# EAGLE design G888b (EAGLE 4.11)
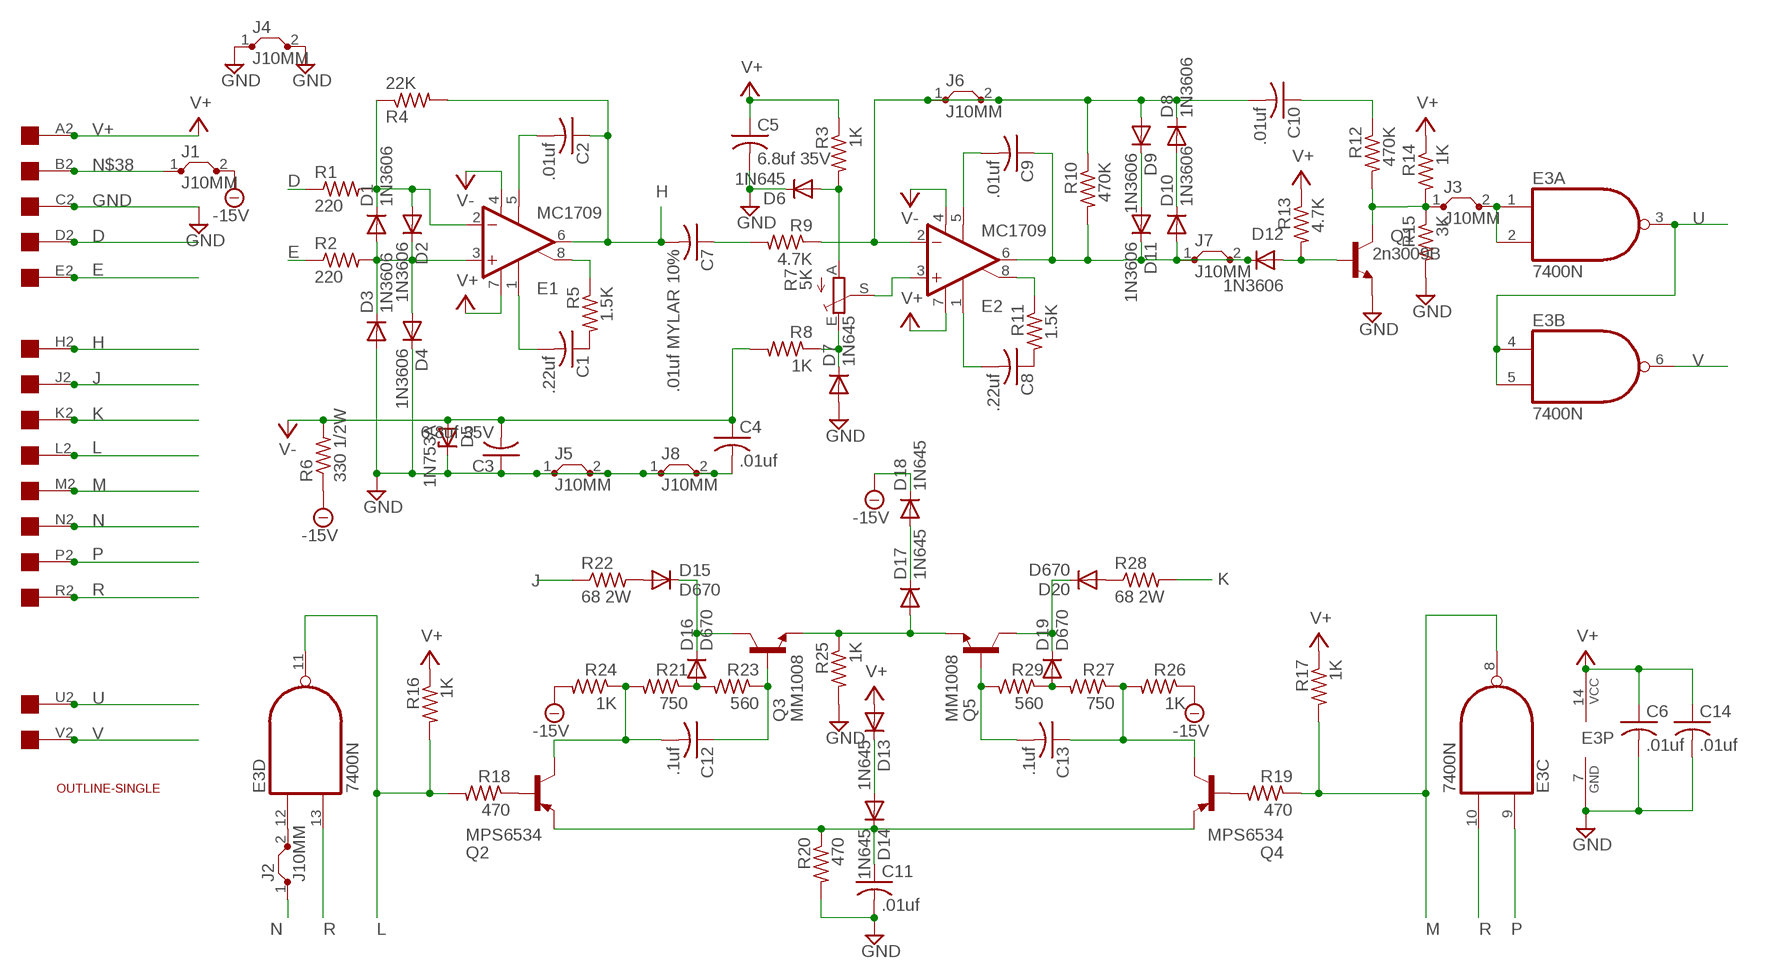
[diagram p0: schematic, sheet 1]

## Parts
C1  .22uf  C-US050-025X075  [C050-025X075]
C2  .01uf  C-US050-025X075  [C050-025X075]
C3  6.8uf 35V  C-US102-043X133  [C102-043X133]
C4  .01uf  C-US050-025X075  [C050-025X075]
C5  6.8uf 35V  C-US102-043X133  [C102-043X133]
C6  .01uf  C-US050-025X075  [C050-025X075]
C7  .01uf MYLAR 10%  C-US150-054X183  [C150-054X183]
C8  .22uf  C-US050-025X075  [C050-025X075]
C9  .01uf  C-US050-025X075  [C050-025X075]
C10  .01uf  C-US050-025X075  [C050-025X075]
C11  .01uf  C-US050-025X075  [C050-025X075]
C12  .1uf  C-US050-025X075  [C050-025X075]
C13  .1uf  C-US050-025X075  [C050-025X075]
C14  .01uf  C-US050-025X075  [C050-025X075]
D1  1N3606  1N4004  [DO41-10]
D2  1N3606  1N4004  [DO41-10]
D3  1N3606  1N4004  [DO41-10]
D4  1N3606  1N4004  [DO41-10]
D5  1N753A  ZENER-DIODEDO35Z10  [DO35Z10]
D6  1N645  1N4004  [DO41-10]
D7  1N645  1N4004  [DO41-10]
D8  1N3606  1N4004  [DO41-10]
D9  1N3606  1N4004  [DO41-10]
D10  1N3606  1N4004  [DO41-10]
D11  1N3606  1N4004  [DO41-10]
D12  1N3606  1N4004  [DO41-10]
D13  1N645  1N4004  [DO41-10]
D14  1N645  1N4004  [DO41-10]
D15  D670  1N4004  [DO41-10]
D16  D670  1N4004  [DO41-10]
D17  1N645  1N4004  [DO41-10]
D18  1N645  1N4004  [DO41-10]
D19  D670  1N4004  [DO41-10]
D20  D670  1N4004  [DO41-10]
E1  MC1709  LM3080N  [DIL08]
E2  MC1709  LM3080N  [DIL08]
E3  7400N  [DIL14]
J1  J10MM  [10]
J2  J10MM  [10]
J3  J10MM  [10]
J4  J10MM  [10]
J5  J10MM  [10]
J6  J10MM  [10]
J7  J10MM  [10]
J8  J10MM  [10]
Q1  2n3009B  2N1711  [TO39]
Q2  MPS6534  2N5415  [TO39]
Q3  MM1008  2N1711  [TO39]
Q4  MPS6534  2N5415  [TO39]
Q5  MM1008  2N1711  [TO39]
R1  220  R-US_0207/10  [0207/10]
R2  220  R-US_0207/10  [0207/10]
R3  1K  R-US_0207/10  [0207/10]
R4  22K  R-US_0207/10  [0207/10]
R5  1.5K  R-US_0207/10  [0207/10]
R6  330 1/2W  R-US_0411/15  [0411/15]
R7  5K  TRIM_EU-PTSPIN  [PT-SPIN]
R8  1K  R-US_0207/10  [0207/10]
R9  4.7K  R-US_0207/10  [0207/10]
R10  470K  R-US_0207/10  [0207/10]
R11  1.5K  R-US_0207/10  [0207/10]
R12  470K  R-US_0207/10  [0207/10]
R13  4.7K  R-US_0207/10  [0207/10]
R14  1K  R-US_0207/10  [0207/10]
R15  3K  R-US_0207/10  [0207/10]
R16  1K  R-US_0207/10  [0207/10]
R17  1K  R-US_0207/10  [0207/10]
R18  470  R-US_0207/10  [0207/10]
R19  470  R-US_0207/10  [0207/10]
R20  470  R-US_0207/10  [0207/10]
R21  750  R-US_0207/10  [0207/10]
R22  68 2W  R-US_0817/22  [P0817/22]
R23  560  R-US_0207/10  [0207/10]
R24  1K  R-US_0207/10  [0207/10]
R25  1K  R-US_0207/10  [0207/10]
R26  1K  R-US_0207/10  [0207/10]
R27  750  R-US_0207/10  [0207/10]
R28  68 2W  R-US_0817/22  [P0817/22]
R29  560  R-US_0207/10  [0207/10]
U$1  EDGE-1  [EDGE-CON1]
U$4  OUTLINE-SINGLE  [SINGLE]

## Nets
-15V: D18.C J1.2 R6.1 R24.2 R26.1
D: R1.1 U$1.D2
E: R2.1 U$1.E2
GND: C3.1 C4.2 C5.2 C6.2 C11.2 C14.2 D3.A D4.C D5.C D6.C D7.A E3.7(P:GND) J4.1 J4.2 J5.1 J5.2 J8.1 J8.2 Q1.1(E) R15.2 R20.2 R25.2 U$1.C2
H: C2.1 C7.2 E1.6(OUT) R4.2 U$1.H2
J: R22.1 U$1.J2
K: R28.2 U$1.K2
L: E3.11(D:O) R16.2 R18.2 U$1.L2
M: E3.8(C:O) R17.2 R19.1 U$1.M2
N: J2.1 U$1.N2
N$1: C1.1 R5.2
N$2: C8.1 R11.2
N$3: D1.C D2.A E1.2(-IN) R1.2 R4.1
N$4: D1.A D2.C D3.C D4.A E1.3(+IN) R2.2
N$5: C8.2 E2.1(ON1)
N$6: C1.2 E1.1(ON1)
N$7: E1.8(ON2) R5.1
N$8: C2.2 E1.5(OPT)
N$9: D6.A R3.2 R7.A
N$10: C10.2 D8.C D9.A E2.2(-IN) J6.1 J6.2 R9.1 R10.1
N$11: E2.3(+IN) R7.S
N$12: D7.C R7.E R8.1
N$13: E2.8(ON2) R11.1
N$14: C9.2 E2.5(OPT)
N$15: C9.1 D10.A D11.C D12.C E2.6(OUT) J7.1 J7.2 R10.2
N$16: C7.1 R9.2
N$17: D9.C D11.A
N$18: D8.A D10.C
N$19: C10.1 R12.1
N$20: D12.A Q1.2(B) R13.2
N$21: J3.1 Q1.3(C) R12.2 R14.2 R15.1
N$22: D17.A Q3.1(E) Q5.1(E) R25.1
N$23: C11.1 D14.C Q2.1(E) Q4.1(E) R20.1
N$24: D13.C D14.A
N$25: Q2.2(B) R18.1
N$26: Q4.2(B) R19.2
N$27: D15.A R22.2
N$28: D16.A R21.1 R23.2
N$29: C12.2 Q2.3(C) R21.2 R24.1
N$30: C12.1 Q3.2(B) R23.1
N$31: D19.A R27.2 R29.1
N$32: C13.1 Q4.3(C) R26.2 R27.1
N$33: C13.2 Q5.2(B) R29.2
N$34: D20.A R28.1
N$35: D15.C D16.C Q3.3(C)
N$36: D19.C D20.C Q5.3(C)
N$37: D17.C D18.A
N$38: J1.1 U$1.B2
N$39: E3.12(D:I0) J2.2
N$40: E3.1(A:I0) E3.2(A:I1) J3.2
P: E3.9(C:I0) U$1.P2
R: E3.10(C:I1) E3.13(D:I1) U$1.R2
U: E3.3(A:O) E3.4(B:I0) E3.5(B:I1) U$1.U2
V: E3.6(B:O) U$1.V2
V+: C5.1 C6.1 C14.1 D13.A E1.7(V+) E2.7(V+) E3.14(P:VCC) R3.1 R13.1 R14.1 R16.1 R17.1 U$1.A2
V-: C3.2 C4.1 D5.A E1.4(V-) E2.4(V-) R6.2 R8.2
Unconnected: U$1.F2 U$1.S2 U$1.T2

## Library data of the parts
C1-C14 = rcl:C-US: CAPACITOR, American symbol
D1-D4 D6-D20 = diode:1N4004: DIODE general purpose rectifier, 1 A
D5 = diode:ZENER-DIODE: Z-Diode
E1 E2 = linear:*3080: OP AMP
E3 = 74xx-us:74*00: Quad 2-input NAND gate
J1-J8 = jumper:J: Bridge
Q1 Q3 Q5 = transistor-npn:2N1711: NPN Transistor
Q2 Q4 = transistor-pnp:2N5415*: PNP Transistror
R1-R6 R8-R29 = rcl:R-US_: RESISTOR, American symbol
R7 = pot:TRIM_EU-: POTENTIOMETER
U$1 = dec-con:EDGE-1: Single-Sided DEC Edge Connector -- (side 2)
U$4 = dec-con:OUTLINE-*: Board outlines for DEC boards.

## Board
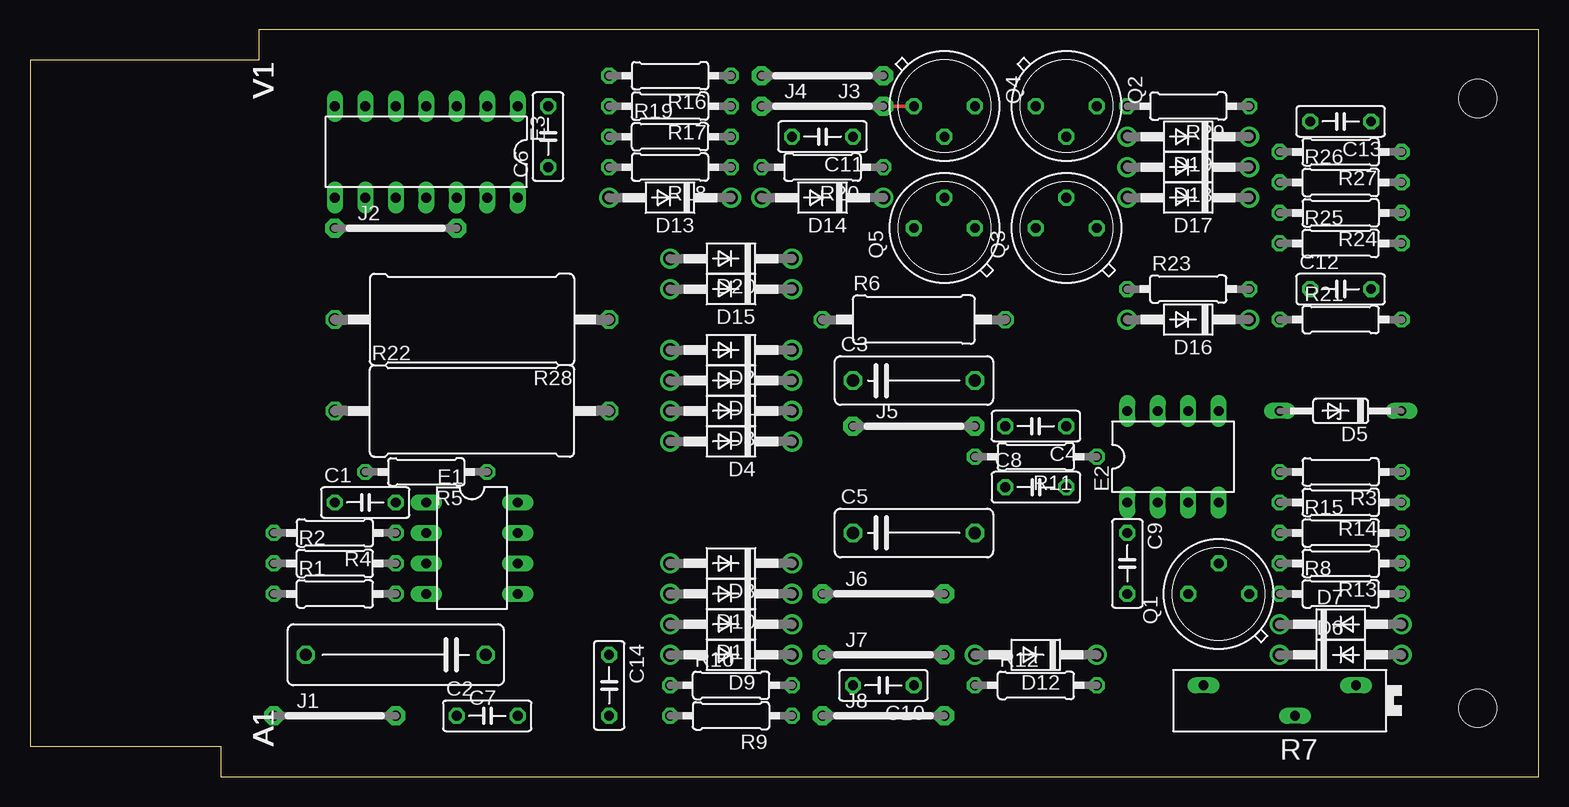
[diagram p1: board, top side]
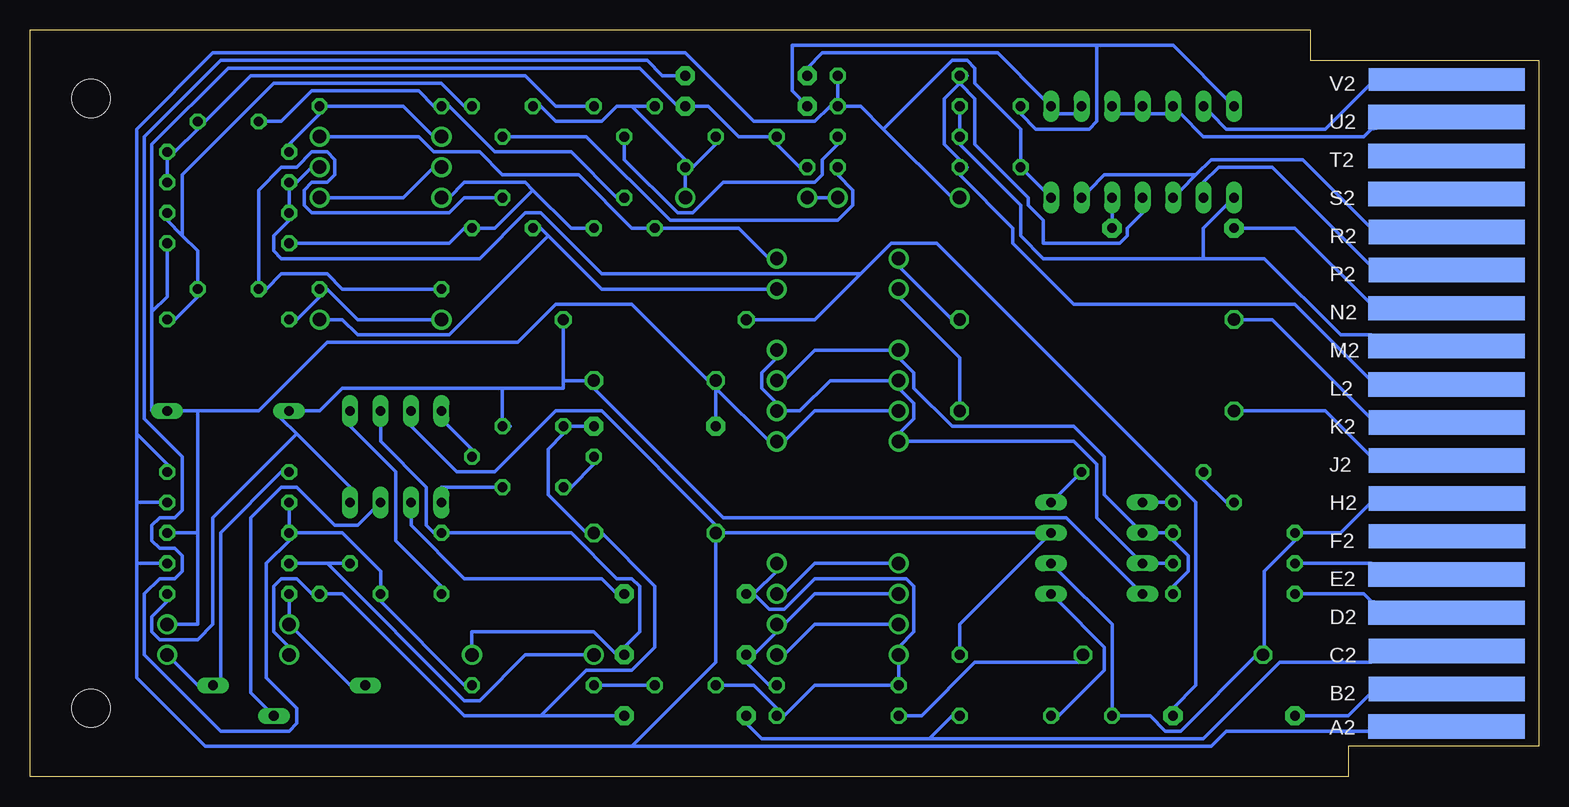
[diagram p2: board, bottom side, seen from below]

Size 125.73 x 62.23 mm. Coordinates in mm from the lower left corner, seen from the top.
Copper layers (1*16): Top 0.035mm / dielectric 1.5mm / Bottom 0.035mm
Design rules "10mils": minimum track width 12mil, minimum drill 28mil, track to track 10mil, track to pad 10mil, pad to pad 10mil, via to via 10mil, smd to smd 10mil, copper to edge 25mil, drill to drill 10mil, minimum pad ring 10mil, minimum via ring 8mil, stop-mask expansion 0mil, vias tented up to drill 0mil, thermal gap 10mil

### Footprints (pad centres in the part's own frame; a part is rotated, then mirrored left to right if it is on the bottom)
C050-025X075 = drill 0.813 octagon: 1 -2.54,0; 2 2.54,0
C102-043X133 = drill 1.016 octagon: 1 -5.08,0; 2 5.08,0
C150-054X183 = drill 1.016 octagon: 1 -7.493,0; 2 7.493,0
DO41-10 = drill 1.118 round: A 5.08,0; C -5.08,0
DO35Z10 = drill 0.813 long: A 5.08,0; C -5.08,0
DIL08 = drill 0.813 long: 1 -3.81,-3.81; 2 -1.27,-3.81; 3 1.27,-3.81; 4 3.81,-3.81; 5 3.81,3.81; 6 1.27,3.81; 7 -1.27,3.81; 8 -3.81,3.81
DIL14 = drill 0.813 long: 1 -7.62,-3.81; 2 -5.08,-3.81; 3 -2.54,-3.81; 4 0,-3.81; 5 2.54,-3.81; 6 5.08,-3.81; 7 7.62,-3.81; 8 7.62,3.81; 9 5.08,3.81; 10 2.54,3.81; 11 0,3.81; 12 -2.54,3.81; 13 -5.08,3.81; 14 -7.62,3.81
10 = drill 0.813 pad 1.6 octagon: 1 -5.08,0; 2 5.08,0
TO39 = drill 0.813 octagon: 1 0,-2.54; 2 2.54,0; 3 0,2.54
0207/10 = drill 0.813 octagon: 1 -5.08,0; 2 5.08,0
0411/15 = drill 0.914 octagon: 1 -7.62,0; 2 7.62,0
PT-SPIN = drill 0.813 long: A -6.35,-1.27; E 6.35,-1.27; S -1.27,1.27
P0817/22 = drill 1.016 octagon: 1 -11.43,0; 2 11.43,0
EDGE-CON1 = smd 13.017 x 2.032 bottom: A2 7.69,4.194; B2 7.668,7.328; C2 7.668,10.49; D2 7.693,13.665; E2 7.693,16.84; F2 7.642,20.041; H2 7.642,23.19; J2 7.668,26.34; K2 7.668,29.515; L2 7.693,32.69; M2 7.693,35.89; N2 7.693,39.04; P2 7.668,42.24; R2 7.668,45.39; S2 7.693,48.565; T2 7.693,51.74; U2 7.693,54.966 | smd 13.017 x 1.905 bottom: V2 7.668,58.102
SINGLE = hole 3.175: 120.65,56.515; 120.65,5.715

### Placement (x,y rotation side)
C1  27.94,22.86 0 top
C2  38.1,5.08 0 top
C3  73.66,33.02 0 top
C4  83.82,29.21 180 top
C5  73.66,20.32 0 top
C6  43.18,53.34 90 top
C7  30.48,10.16 180 top
C8  83.82,24.13 0 top
C9  91.44,17.78 270 top
C10  71.12,7.62 180 top
C11  66.04,53.34 180 top
C12  109.22,40.64 0 top
C13  109.22,54.61 180 top
C14  48.26,7.62 270 top
D1  58.42,33.02 180 top
D2  58.42,35.56 180 top
D3  58.42,30.48 180 top
D4  58.42,27.94 180 top
D5  109.22,30.48 180 top
D6  109.22,10.16 0 top
D7  109.22,12.7 0 top
D8  58.42,17.78 180 top
D9  58.42,10.16 180 top
D10  58.42,15.24 180 top
D11  58.42,12.7 180 top
D12  83.82,10.16 180 top
D13  53.34,48.26 180 top
D14  66.04,48.26 180 top
D15  58.42,40.64 180 top
D16  96.52,38.1 180 top
D17  96.52,48.26 180 top
D18  96.52,50.8 180 top
D19  96.52,53.34 180 top
D20  58.42,43.18 180 top
E1  36.83,19.05 270 top
E2  95.25,26.67 0 top
E3  33.02,52.07 180 top
J1  25.4,5.08 0 top
J2  30.48,45.72 0 top
J3  66.04,58.42 180 top
J4  66.04,55.88 0 top
J5  73.66,29.21 0 top
J6  71.12,15.24 0 top
J7  71.12,10.16 0 top
J8  71.12,5.08 0 top
Q1  99.06,15.24 90 top
Q2  86.36,55.88 270 top
Q3  86.36,45.72 90 top
Q4  76.2,55.88 270 top
Q5  76.2,45.72 90 top
R1  25.4,15.24 0 top
R2  25.4,17.78 0 top
R3  109.22,25.4 180 top
R4  25.4,20.32 180 top
R5  33.02,25.4 180 top
R6  73.66,38.1 0 top
R7  104.14,6.35 180 top
R8  109.22,15.24 0 top
R9  58.42,5.08 180 top
R10  58.42,7.62 0 top
R11  83.82,26.67 180 top
R12  83.82,7.62 0 top
R13  109.22,17.78 180 top
R14  109.22,22.86 180 top
R15  109.22,20.32 0 top
R16  53.34,58.42 180 top
R17  53.34,55.88 180 top
R18  53.34,50.8 180 top
R19  53.34,53.34 0 top
R20  66.04,50.8 180 top
R21  109.22,38.1 0 top
R22  36.83,30.48 0 top
R23  96.52,40.64 0 top
R24  109.22,46.99 180 top
R25  109.22,44.45 0 top
R26  109.22,49.53 0 top
R27  109.22,52.07 180 top
R28  36.83,38.1 180 top
R29  96.52,55.88 180 top
U$1  0,0 0 top
U$4  0,0 0 top

### Tracks (layer width: path | path; a pad name or v marks a point on that pad's centre or on a via)
-15V
  Bottom 0.305: D18.C 102.24,50.8 103.51,49.53 R26.1 104.14,48.9 104.14,47.62 R24.2 104.14,46.35 105.41,45.09 105.41,43.81 104.78,43.18 88.27,43.18 84.46,46.99 83.19,46.99 78.11,41.91 56.52,41.91 | 56.52,41.91 53.98,44.45 50.17,44.45 28.58,22.86 28.58,7.62 30.48,5.71 J1.2 | 56.52,41.91 60.33,38.1 65.41,38.1 R6.1
D
  Bottom 0.305: R1.1 19.69,15.24 14.61,15.24 13.97,14.61 U$1.D2
E
  Bottom 0.305: R2.1 19.69,17.78 13.97,17.78 U$1.E2
GND
  Top 0.305: J4.1 J4.2 73.03,55.88 | J8.1 69.22,5.08
  Top 0.406: 69.22,5.08 J8.2 | J5.2 J5.1
  Bottom 0.305: D6.C 104.14,10.79 105.41,12.06 105.41,15.88 104.78,16.51 103.51,16.51 102.24,15.24 Q1.1 99.7,15.24 89.54,5.08 83.19,5.08 | 50.8,3.17 48.9,5.08 C14.2 | 50.8,3.17 64.77,3.17 66.04,4.45 J8.1 | 50.8,3.17 27.94,3.17 21.59,9.53 13.97,9.53 U$1.C2 | J5.2 C4.2 81.28,28.57 82.55,27.3 82.55,23.5 79.38,20.32 C5.2 78.11,20.32 73.66,15.88 73.66,10.79 75.57,8.89 79.38,8.89 83.19,5.08 | J5.1 68.58,32.38 | 68.58,32.38 64.14,27.94 D4.C 62.87,27.94 60.33,30.48 D3.A | 68.58,32.38 C3.1 69.22,33.02 75.57,39.37 81.92,39.37 85.09,36.2 100.97,36.2 106.68,30.48 111.76,30.48 | 36.83,60.96 62.23,60.96 62.23,57.15 J4.1 | 36.83,60.96 30.48,60.96 E3.7 | 36.83,60.96 36.83,54.61 37.47,53.98 41.91,53.98 43.18,55.24 C6.2 | 115.57,38.73 114.3,40.01 R25.2 | 115.57,38.73 115.57,30.48 D5.C 111.76,30.48 | J8.2 83.19,5.08 | 115.57,38.73 115.57,52.7 109.22,59.05 74.93,59.05 71.76,55.88 J4.2 69.22,55.88 66.68,53.34 C11.2 63.5,52.7 61.6,50.8 R20.2 | 111.76,20.32 R15.2 | D7.A 111.76,12.7 111.76,20.32 | 111.76,30.48 111.76,20.32
H
  Bottom 0.305: U$1.H2 13.97,22.86 16.51,20.32 19.69,20.32 R4.2 20.32,19.68 22.86,17.14 22.86,10.79 C7.2 23.5,10.16 29.85,3.81 31.12,3.81 32.39,5.08 34.93,5.08 C2.1 35.56,5.71 35.56,12.7 40.01,17.14 E1.6
J
  Bottom 0.305: R22.1 24.77,30.48 17.78,30.48 13.97,26.67 U$1.J2
K
  Bottom 0.305: R28.2 24.77,38.1 22.23,38.1 13.97,29.84 U$1.K2
L
  Bottom 0.305: 48.26,57.78 49.53,56.52 49.53,52.7 48.26,51.44 R18.2 | 48.26,57.78 R16.2 | U$1.L2 13.97,33.02 20.32,39.37 36.2,39.37 38.74,39.37 43.82,44.45 43.82,45.72 48.26,50.16 R18.2 | E3.11 33.02,46.99 34.29,45.72 34.29,45.09 34.93,44.45 36.83,44.45 39.37,44.45 41.28,44.45 41.28,46.35 42.55,47.62 42.55,48.26 46.99,52.7 46.99,56.52 48.26,57.78 | R16.2 47.63,58.42 | R18.2 47.63,50.8 | 48.26,57.78 R16.2
M
  Bottom 0.305: R19.1 48.26,53.98 48.26,55.24 R17.2 | 27.94,43.18 27.94,45.72 26.04,47.62 E3.8 | 27.94,43.18 38.74,43.18 41.28,43.18 43.18,45.09 43.18,47.62 48.26,52.7 | 48.26,52.7 R19.1 | 13.97,36.83 U$1.M2 13.97,36.83 | 13.97,36.83 16.51,36.83 22.86,43.18 27.94,43.18 | 48.26,52.7 R19.1
N
  Bottom 0.305: J2.1 24.77,45.72 20.32,45.72 13.97,39.37 U$1.N2
N$1
  Bottom 0.305: C1.1 26.04,22.86 27.94,24.77 R5.2
N$2
  Bottom 0.305: C8.1 80.65,24.13 78.74,26.04 R11.2
N$3
  Bottom 0.305: R1.2 30.48,15.88 29.21,17.14 29.21,18.41 30.48,19.68 R4.1 31.12,20.32 31.75,20.32 | 31.75,20.32 E1.2 | D1.C 62.87,33.02 60.33,35.56 53.98,35.56 D2.A 53.34,34.92 52.07,33.66 52.07,32.38 48.9,29.21 38.74,29.21 36.2,26.67 36.2,23.5 33.66,20.95 E1.2 | 31.75,20.32 E1.2
N$4
  Bottom 0.305: D2.C 63.5,34.92 64.77,33.66 64.77,32.38 63.5,31.11 D3.C 62.87,30.48 61.6,30.48 59.06,33.02 53.98,33.02 D1.A 53.34,32.38 52.07,31.11 52.07,29.84 53.34,28.57 D4.A 52.71,27.94 38.74,27.94 36.83,26.04 36.83,21.59 33.66,18.41 E1.3 31.75,17.78 31.12,17.78 R2.2
N$5
  Bottom 0.305: C8.2 87,24.13 91.44,24.13 E2.1
N$6
  Bottom 0.305: C1.2 31.12,22.86 31.75,22.86 E1.1
N$7
  Bottom 0.305: R5.1 40.01,23.5 E1.8
N$8
  Bottom 0.305: C2.2 40.01,5.08 36.2,8.89 36.2,10.79 40.01,14.61 E1.5
N$9
  Bottom 0.305: D6.A 111.76,7.62 R7.A 109.86,8.26 109.86,20.32 104.78,25.4 R3.2
N$10
  Top 0.406: J6.1 J6.2
  Bottom 0.305: 65.41,15.24 63.5,17.14 D8.C | 65.41,15.24 J6.1 65.41,15.24 | C10.2 67.95,7.62 65.41,7.62 63.5,5.71 R9.1 62.87,5.08 60.33,7.62 53.98,7.62 R10.1 53.34,8.26 53.34,9.53 D9.A 53.34,10.79 52.07,12.06 52.07,15.88 52.71,16.51 60.33,16.51 62.87,13.97 64.14,13.97 65.41,15.24 | E2.2 93.98,21.59 93.98,20.95 89.54,16.51 78.11,16.51 76.84,15.24 J6.2
N$11
  Bottom 0.305: R7.S 107.32,6.99 107.32,17.78 107.32,21.59 104.78,24.13 103.51,24.13 100.33,20.95 98.43,20.95 97.16,22.23 E2.3
N$12
  Bottom 0.305: R7.E 99.06,7.62 D7.C 104.14,13.34 104.14,14.61 R8.1
N$13
  Bottom 0.305: R11.1 88.9,27.3 91.44,29.84 E2.8
N$14
  Bottom 0.305: C9.2 91.44,15.88 95.25,19.68 95.25,25.4 99.06,29.21 E2.5
N$15
  Top 0.305: J7.1 69.22,10.16
  Top 0.406: 69.22,10.16 J7.2
  Bottom 0.305: D12.C 88.9,10.79 88.9,12.06 78.74,12.06 76.84,10.16 J7.2 76.2,10.79 74.93,12.06 74.93,15.88 75.57,16.51 76.84,16.51 80.65,20.32 90.81,20.32 C9.1 92.08,20.32 92.71,20.95 92.71,24.13 96.52,27.94 96.52,29.21 E2.6 | R10.2 64.14,7.62 66.04,9.53 J7.1 65.41,10.16 63.5,12.06 D11.C 62.87,12.7 60.33,15.24 53.98,15.24 D10.A
N$16
  Bottom 0.305: R9.2 52.71,5.08 51.44,5.08 46.99,9.53 38.1,9.53 C7.1
N$17
  Bottom 0.305: D11.A 53.98,12.7 60.33,12.7 62.87,10.16 D9.C
N$18
  Bottom 0.305: D8.A 53.98,17.78 60.33,17.78 62.87,15.24 D10.C
N$19
  Bottom 0.305: C10.1 74.3,7.62 78.11,7.62 R12.1
N$20
  Bottom 0.305: 100.97,17.78 99.7,17.78 Q1.2 | 100.97,17.78 103.51,17.78 R13.2 | 100.97,17.78 89.54,6.35 88.27,6.35 84.46,10.16 79.38,10.16 D12.A
N$21
  Top 0.406: J3.1 63.5,58.42
  Bottom 0.305: R15.1 104.14,20.95 104.14,22.23 R14.2 | R12.2 89.54,7.62 96.52,14.61 Q1.3 96.52,15.88 96.52,17.14 99.7,20.32 103.51,20.32 R15.1 | J3.1 71.76,58.42 73.03,58.42 74.3,59.69 109.86,59.69 116.21,53.34 116.21,29.84 113.03,26.67 113.03,22.23 113.67,21.59 114.94,21.59 115.57,20.95 115.57,19.68 114.94,19.05 113.67,19.05 113.03,18.41 113.03,17.14 113.67,16.51 114.94,16.51 116.21,15.24 116.21,10.16 109.86,3.81 104.14,3.81 103.51,4.45 103.51,5.71 106.05,8.26 106.05,17.78 104.14,19.68 R15.1
N$22
  Bottom 0.305: 83.82,48.9 84.46,49.53 89.54,49.53 90.81,48.26 D17.A | 83.82,48.9 80.65,45.72 79.38,45.72 Q5.1 | R25.1 103.51,44.45 90.81,44.45 89.54,45.72 Q3.1 88.27,45.72 87,45.72 83.82,48.9
N$23
  Bottom 0.305: R20.1 71.12,50.16 71.12,48.9 D14.C | C11.1 68.58,52.7 70.49,50.8 R20.1 | 75.57,55.88 74.3,55.88 Q4.1 | 75.57,55.88 76.84,55.88 78.11,54.61 79.38,54.61 81.92,54.61 83.19,55.88 Q2.1 | 75.57,55.88 71.12,51.44 R20.1
N$24
  Bottom 0.305: D13.C 59.06,48.26 60.33,48.26 D14.A
N$25
  Bottom 0.305: R18.1 58.42,50.16 57.15,48.9 57.15,47.62 58.42,46.35 72.39,46.35 79.38,53.34 85.73,53.34 Q2.2
N$26
  Bottom 0.305: R19.2 58.42,52.7 59.69,51.44 59.69,50.16 60.33,49.53 67.95,49.53 70.49,46.99 71.76,46.99 76.2,51.44 76.2,52.7 Q4.2
N$27
  Bottom 0.305: R22.2 48.26,31.11 48.26,34.92 53.34,40.01 D15.A
N$28
  Bottom 0.305: R21.1 103.51,38.1 101.6,40.01 R23.2 100.97,40.64 98.43,38.1 92.08,38.1 D16.A
N$29
  Bottom 0.305: R21.2 113.67,38.1 111.76,40.01 C12.2 111.76,41.27 111.76,43.81 113.03,45.09 | 113.03,45.09 114.3,46.35 R24.1 | 113.03,45.09 113.03,50.16 105.41,57.78 91.44,57.78 89.54,55.88 Q2.3
N$30
  Bottom 0.305: R23.1 92.08,40.64 99.7,40.64 100.97,41.91 104.78,41.91 106.05,40.64 C12.1 106.68,41.27 106.68,48.9 104.78,50.8 103.51,50.8 102.24,52.07 100.97,52.07 100.33,51.44 100.33,50.16 100.97,49.53 102.24,49.53 102.87,48.9 102.87,47.62 102.24,46.99 90.81,46.99 89.54,48.26 87,48.26 Q3.2
N$31
  Bottom 0.305: R27.2 104.14,52.7 101.6,55.24 R29.1 100.97,55.88 94.62,55.88 92.08,53.34 D19.A
N$32
  Bottom 0.305: R26.2 114.3,50.16 114.3,51.44 R27.1 113.67,52.07 111.76,53.98 C13.1 111.13,54.61 107.32,58.42 84.46,58.42 81.92,55.88 79.38,55.88 Q4.3
N$33
  Bottom 0.305: Q5.2 76.84,48.26 80.65,52.07 87,52.07 90.81,55.88 R29.2 92.08,55.88 93.35,57.15 102.24,57.15 104.78,54.61 106.05,54.61 C13.2
N$34
  Bottom 0.305: R28.1 48.9,38.1 53.34,42.55 D20.A
N$35
  Bottom 0.305: 82.55,45.09 78.11,40.64 64.14,40.64 D15.C | 82.55,45.09 83.19,45.72 Q3.3 | 82.55,45.09 90.81,36.83 98.43,36.83 99.7,38.1 100.97,38.1 D16.C
N$36
  Bottom 0.305: D20.C 64.14,43.18 66.68,45.72 73.03,45.72 Q5.3 74.3,45.72 75.57,45.72 80.01,50.16 86.36,50.16 88.27,52.07 92.08,52.07 93.35,53.34 100.97,53.34 D19.C
N$37
  Bottom 0.305: D17.C 100.97,48.26 94.62,48.26 92.08,50.8 D18.A
N$38
  Bottom 0.305: J1.1 19.69,5.08 15.88,5.08 13.97,6.99 U$1.B2
N$39
  Bottom 0.305: E3.12 35.56,46.99 35.56,46.35 J2.2
N$40
  Bottom 0.305: E3.2 38.74,55.24 40.01,55.24 E3.1 41.28,56.52 45.09,60.33 59.69,60.33 60.96,59.05 J3.2
P
  Bottom 0.305: E3.9 27.94,49.53 26.67,50.8 22.23,50.8 13.97,42.55 U$1.P2
R
  Bottom 0.305: 28.58,50.16 27.31,51.44 19.69,51.44 13.97,45.72 U$1.R2 | 28.58,50.16 29.85,48.9 E3.10 | 28.58,50.16 36.2,50.16 37.47,48.9 E3.13
U
  Bottom 0.305: E3.3 34.93,55.24 33.66,55.24 E3.4 32.39,55.24 31.12,55.24 E3.5 29.85,55.24 27.94,53.34 14.61,53.34 13.97,53.98 U$1.U2
V
  Bottom 0.305: E3.6 27.31,55.24 26.04,53.98 17.78,53.98 13.97,57.78 U$1.V2
V+
  Bottom 0.305: C14.1 48.26,12.7 E1.7 C5.1 | R17.1 R16.1 | E3.14 C6.1 43.18,53.98 46.99,57.78 46.99,59.05 47.63,59.69 48.9,59.69 54.61,53.98 | 54.61,53.98 48.9,48.26 D13.A | 54.61,53.98 56.52,55.88 R17.1 | 116.84,28.57 116.84,53.98 110.49,60.33 71.12,60.33 65.41,54.61 60.33,54.61 59.06,55.88 R17.1 | 116.84,28.57 114.3,26.04 R3.1 | 116.84,22.86 116.84,28.57 | 116.84,17.78 116.84,22.86 | 116.84,22.86 R14.1 | U$1.A2 13.97,3.81 26.04,3.81 27.31,2.54 75.57,2.54 | 75.57,2.54 111.13,2.54 116.84,8.26 116.84,17.78 | 75.57,2.54 68.58,9.53 C5.1 | E2.7 93.98,29.21 90.17,25.4 87,25.4 81.92,30.48 78.11,30.48 68.58,20.95 C5.1 | 116.84,17.78 R13.1
V-
  Bottom 0.305: 85.73,29.21 C4.1 86.36,29.84 86.36,32.38 | C3.2 79.38,33.02 | 81.28,33.02 81.28,32.38 86.36,32.38 | 81.28,33.02 81.28,36.83 81.28,37.47 R6.2 | E1.4 33.66,15.88 39.37,21.59 41.91,21.59 67.95,21.59 68.58,22.23 78.74,32.38 C3.2 | 103.51,28.57 104.78,29.84 D5.A 102.87,30.48 101.6,30.48 99.7,32.38 86.36,32.38 | 103.51,28.57 99.06,24.13 E2.4 | 79.38,33.02 81.28,33.02 | C3.2 79.38,33.02 | 103.51,28.57 110.49,21.59 110.49,12.7 111.76,11.43 114.94,11.43 115.57,12.06 115.57,13.34 114.3,14.61 R8.2

### Text on the board
tNames: V1 | V1 | V1 | V1 | V1 | V1 | V1 | V1 | V1 | V1 | V1 | V1 | V1 | V1 | V1 | V1 | V1 | V1 | V1 | V1 | V1 | V1 | V1 | V1 | V1 | V1 | V1 | V1 | V1 | V1 | V1 | V1 | A1 | A1 | A1 | A1 | A1 | A1 | A1 | A1 | A1 | A1 | A1 | A1 | A1 | A1 | A1 | A1 | A1 | A1 | A1 | A1 | A1 | A1 | A1 | A1 | A1 | A1 | A1 | A1 | A1 | A1 | A1 | A1